# Altium project VCU.PrjPcb (part 1 of 2)
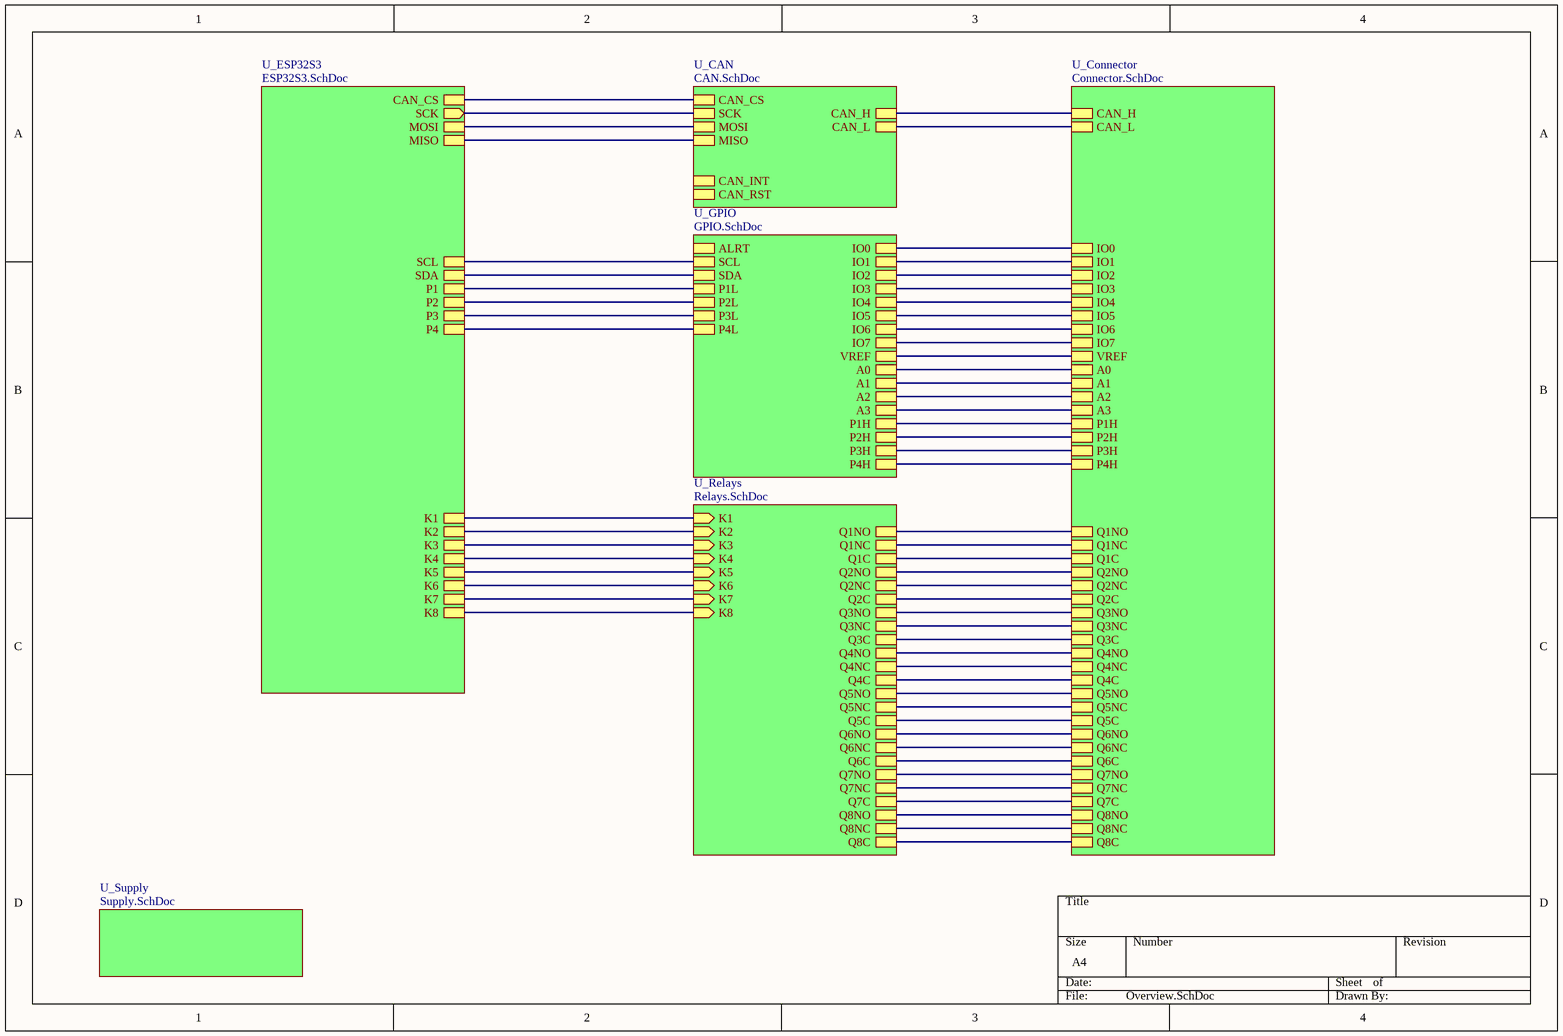
[diagram p0: Overview.SchDoc]
7 sheets, 101 parts. Net scope: hierarchical (ports join the sheet entries above them; power ports are global).
Board file: VCU.PcbDoc
Sheets:
  Overview.SchDoc
    U_ESP32S3 = ESP32S3.SchDoc
    U_CAN = CAN.SchDoc
    U_Relays = Relays.SchDoc
    U_GPIO = GPIO.SchDoc
    U_Supply = Supply.SchDoc
    U_Connector = Connector.SchDoc

## Sheet Overview.SchDoc
size A4; SheetNumber: 1; SheetTotal: 7

### Sub-sheets
U_CAN = CAN.SchDoc: CAN_CS, SCK, MOSI, MISO, CAN_H, CAN_L, CAN_INT, CAN_RST
U_Connector = Connector.SchDoc: Q1NO, Q1NC, Q1C, Q2NO, Q2NC, Q2C, Q3NO, Q3NC, Q3C, Q4NO, Q4NC, Q4C, Q5NO, Q5NC, Q5C, Q6NO, Q6NC, Q6C, Q7NO, Q7NC, Q7C, Q8NO, Q8NC, Q8C, CAN_H, CAN_L, IO0, IO1, IO2, IO3, IO4, IO5, IO6, IO7, VREF, A0, A1, A2, A3, P1H, P2H, P3H, P4H
U_ESP32S3 = ESP32S3.SchDoc: SCK (out), MISO, MOSI, CAN_CS, P1, P2, P3, P4, K1, K2, K3, K4, K5, K6, K7, K8, SDA, SCL
U_GPIO = GPIO.SchDoc: ALRT, SCL, SDA, A0, A1, A2, A3, IO0, IO1, IO2, IO3, IO4, IO5, IO6, IO7, VREF, P1L, P3L, P4L, P2L, P1H, P2H, P3H, P4H
U_Relays = Relays.SchDoc: K1 (in), K2 (in), K3 (in), K4 (in), K5 (in), K6 (in), K7 (in), K8 (in), Q1NO, Q1NC, Q1C, Q2NO, Q2NC, Q2C, Q3NO, Q3NC, Q3C, Q4NO, Q4NC, Q4C, Q5NO, Q5NC, Q5C, Q6NO, Q6NC, Q6C, Q7NO, Q7NC, Q7C, Q8NO, Q8NC, Q8C
U_Supply = Supply.SchDoc: no entries

### Nets
K1: sheet U_ESP32S3/K1, sheet U_Relays/K1
K2: sheet U_ESP32S3/K2, sheet U_Relays/K2
K3: sheet U_ESP32S3/K3, sheet U_Relays/K3
K4: sheet U_ESP32S3/K4, sheet U_Relays/K4
K5: sheet U_ESP32S3/K5, sheet U_Relays/K5
K6: sheet U_ESP32S3/K6, sheet U_Relays/K6
K7: sheet U_ESP32S3/K7, sheet U_Relays/K7
K8: sheet U_ESP32S3/K8, sheet U_Relays/K8
SCL: sheet U_ESP32S3/SCL, sheet U_GPIO/SCL
SDA: sheet U_ESP32S3/SDA, sheet U_GPIO/SDA
NetJ1_1: sheet U_Relays/Q1NO, sheet U_Connector/Q1NO
NetJ1_2: sheet U_Relays/Q1C, sheet U_Connector/Q1C
NetJ1_3: sheet U_Relays/Q1NC, sheet U_Connector/Q1NC
NetJ1_4: sheet U_Relays/Q2NO, sheet U_Connector/Q2NO
NetJ1_5: sheet U_Relays/Q2C, sheet U_Connector/Q2C
NetJ1_6: sheet U_Relays/Q2NC, sheet U_Connector/Q2NC
NetJ1_7: sheet U_Relays/Q3NO, sheet U_Connector/Q3NO
NetJ1_8: sheet U_Relays/Q3C, sheet U_Connector/Q3C
NetJ1_9: sheet U_Relays/Q3NC, sheet U_Connector/Q3NC
NetJ1_10: sheet U_Relays/Q4NO, sheet U_Connector/Q4NO
NetJ1_11: sheet U_Relays/Q4C, sheet U_Connector/Q4C
NetJ1_12: sheet U_Relays/Q4NC, sheet U_Connector/Q4NC
NetJ1_14: sheet U_Relays/Q5NO, sheet U_Connector/Q5NO
NetJ1_15: sheet U_Relays/Q5C, sheet U_Connector/Q5C
NetJ1_16: sheet U_Relays/Q5NC, sheet U_Connector/Q5NC
NetJ1_17: sheet U_Relays/Q6NO, sheet U_Connector/Q6NO
NetJ1_18: sheet U_Relays/Q6C, sheet U_Connector/Q6C
NetJ1_19: sheet U_Relays/Q6NC, sheet U_Connector/Q6NC
NetJ1_20: sheet U_Relays/Q7NO, sheet U_Connector/Q7NO
NetJ1_21: sheet U_Relays/Q7C, sheet U_Connector/Q7C
NetJ1_22: sheet U_Relays/Q7NC, sheet U_Connector/Q7NC
NetJ1_23: sheet U_Relays/Q8NO, sheet U_Connector/Q8NO
NetJ1_24: sheet U_Relays/Q8C, sheet U_Connector/Q8C
NetJ1_25: sheet U_Relays/Q8NC, sheet U_Connector/Q8NC
NetJ2_3: sheet U_GPIO/IO1, sheet U_Connector/IO1
NetJ2_4: sheet U_GPIO/IO3, sheet U_Connector/IO3
NetJ2_5: sheet U_GPIO/IO5, sheet U_Connector/IO5
NetJ2_6: sheet U_GPIO/IO7, sheet U_Connector/IO7
NetJ2_7: sheet U_GPIO/A0, sheet U_Connector/A0
NetJ2_8: sheet U_GPIO/A2, sheet U_Connector/A2
NetJ2_9: sheet U_GPIO/P1H, sheet U_Connector/P1H
NetJ2_10: sheet U_GPIO/P3H, sheet U_Connector/P3H
NetJ2_13: sheet U_CAN/CAN_L, sheet U_Connector/CAN_L
NetJ2_15: sheet U_GPIO/IO0, sheet U_Connector/IO0
NetJ2_16: sheet U_GPIO/IO2, sheet U_Connector/IO2
NetJ2_17: sheet U_GPIO/IO4, sheet U_Connector/IO4
NetJ2_18: sheet U_GPIO/IO6, sheet U_Connector/IO6
NetJ2_19: sheet U_GPIO/VREF, sheet U_Connector/VREF
NetJ2_20: sheet U_GPIO/A1, sheet U_Connector/A1
NetJ2_21: sheet U_GPIO/A3, sheet U_Connector/A3
NetJ2_22: sheet U_GPIO/P2H, sheet U_Connector/P2H
NetJ2_23: sheet U_GPIO/P4H, sheet U_Connector/P4H
NetJ2_25: sheet U_CAN/CAN_H, sheet U_Connector/CAN_H
NetR13_2: sheet U_ESP32S3/P1, sheet U_GPIO/P1L
NetR14_2: sheet U_ESP32S3/P2, sheet U_GPIO/P2L
NetR15_2: sheet U_ESP32S3/P3, sheet U_GPIO/P3L
NetR16_2: sheet U_ESP32S3/P4, sheet U_GPIO/P4L
NetU1_14: sheet U_ESP32S3/SCK, sheet U_CAN/SCK
NetU1_16: sheet U_ESP32S3/MOSI, sheet U_CAN/MOSI
NetU1_17: sheet U_ESP32S3/MISO, sheet U_CAN/MISO
NetU1_18: sheet U_ESP32S3/CAN_CS, sheet U_CAN/CAN_CS

## Sheet ESP32S3.SchDoc
size A4; SheetNumber: 3; SheetTotal: 7
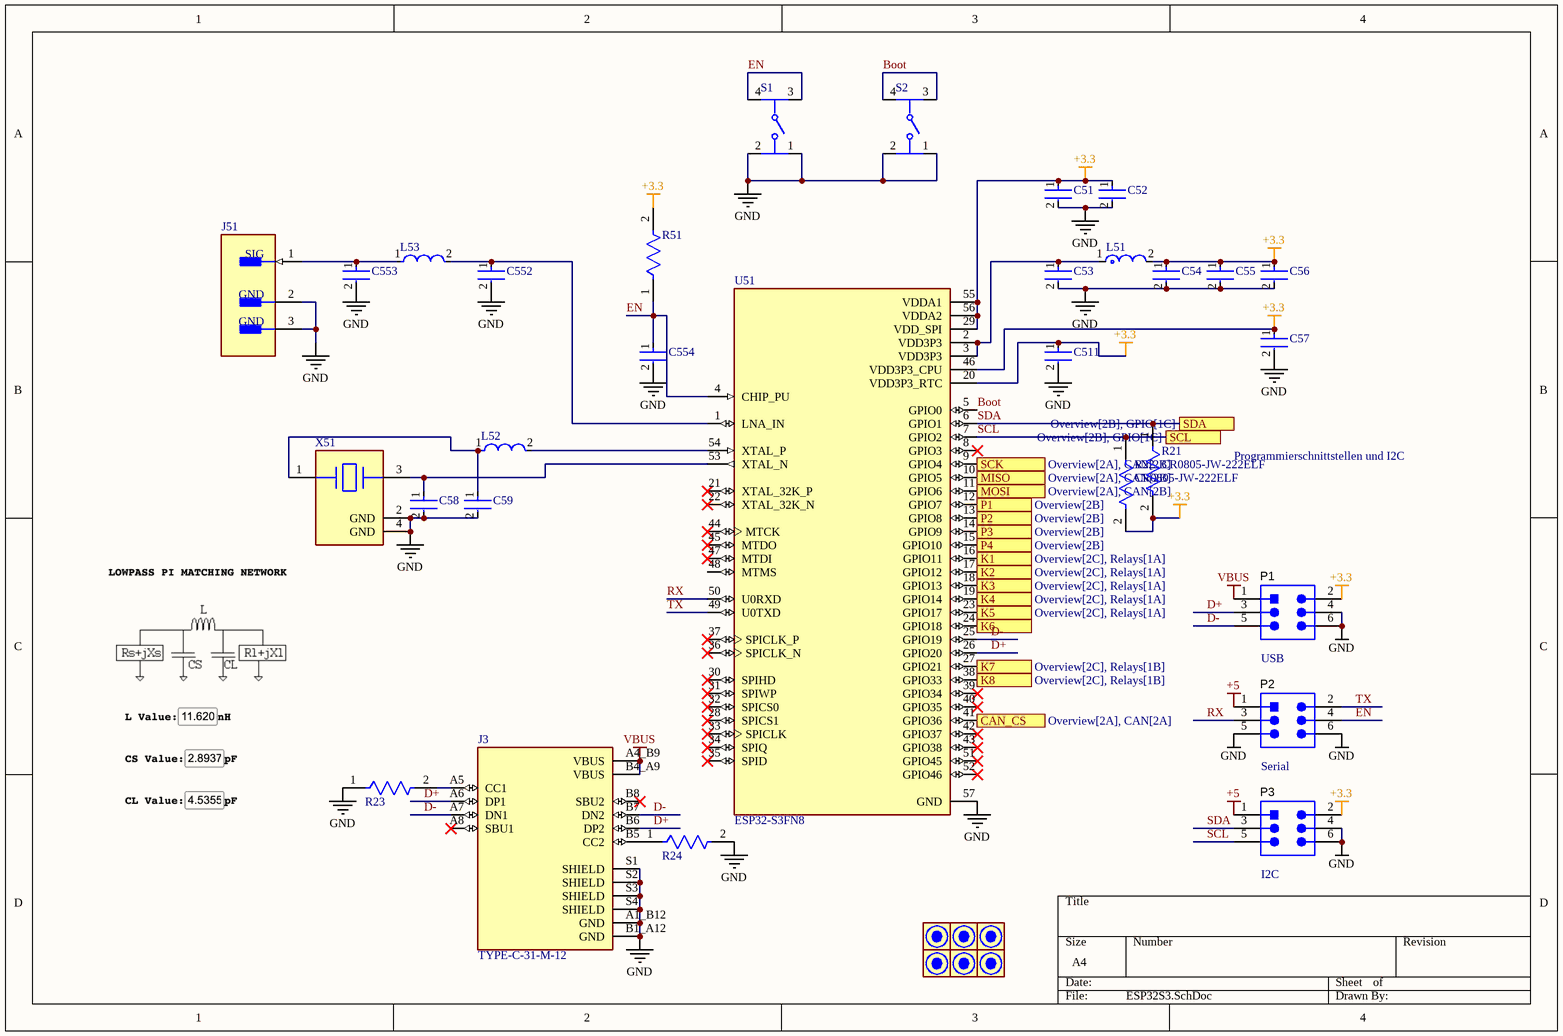
[diagram p1: ESP32S3.SchDoc]

### Parts
(Parts that share a designator on the sheet are numbered #1, #2 ... from top to bottom, then left to right.)
C51  GRM155R61A105KE15D  [FP-GRM15-0_1-MFG]  (value not drawn)
C52  C0603C103K8RACTU  [FP-C0603C-CF-MFG]  (value not drawn)
C53  CC0402KRX7R6BB104  [FP-CC0402-MFG]  (value not drawn)
C54  C0402C104K8PACTU  [FP-C0402-BB-MFG]  (value not drawn)
C55  GRM155R61A105KE15D  [FP-GRM15-0_1-MFG]  (value not drawn)
C56  CL05A106MP5NUNC  [FP-CL05A106MP5NUNC-MFG]  (value not drawn)
C57  C0402C104K8PACTU  [FP-C0402-BB-MFG]  (value not drawn)
C58  C0603C160J5GACTU  [FP-C0603C-CF-MFG]  (value not drawn)
C59  C0603C160J5GACTU  [FP-C0603C-CF-MFG]  (value not drawn)
C511  CC0402KRX7R6BB104  [FP-CC0402-MFG]  (value not drawn)
C552  GJM1555C1H2R8WB01D  [FP-GJM155-0_05-IPC_C]  (value not drawn)
C553  GJM1555C1H4R5BB01D  [FP-GJM155-0_05-IPC_C]  (value not drawn)
C554  C0402C123K4RACTU  [FP-C0402-BB-MFG]  (value not drawn)
J3  TYPE-C-31-M-12  [HRO_TYPE-C-31-M-12]
J51  U.FL-R-SMT-1(10)  [FP-U_FL-R-SMT-1_10-MFG]  (value not drawn)
L51  LQP03TN2N0B02D  [FP-LQP03TG_02-IPC_A]  (value not drawn)
L52  LQW15AN20NG00D  [FP-LQW15AN_00-W0_6-0_1-MFG]  (value not drawn)
L53  LQW15AN11NG00D  [FP-LQW15AN_00-W0_6-0_1-MFG]  (value not drawn)
M*#1  Passermarke  [Passermarke-Footprint-1]  (value not drawn)
M*#2  Passermarke  [Passermarke-Footprint-1]  (value not drawn)
M*#3  Passermarke  [Passermarke-Footprint-1]  (value not drawn)
M*#4  Passermarke  [Passermarke-Footprint-1]  (value not drawn)
M*#5  Passermarke  [Passermarke-Footprint-1]  (value not drawn)
M*#6  Passermarke  [Passermarke-Footprint-1]  (value not drawn)
P1  5-146130-2  [TECO-5-146130-2_V]  (value not drawn)
P2  5-146130-2  [TECO-5-146130-2_V]  (value not drawn)
P3  5-146130-2  [TECO-5-146130-2_V]  (value not drawn)
R21  CR0805-JW-222ELF  [FP-CR0805-IPC_B]
R22  CR0805-JW-222ELF  [FP-CR0805-IPC_B]
R23  CRCW06035K10FKEA  [FP-CRCW0603-e3-IPC_C]  (value not drawn)
R24  CRCW06035K10FKEA  [FP-CRCW0603-e3-IPC_C]  (value not drawn)
R51  CRCW04021K00FKED  [FP-CRCW0402-e3-MFG]  (value not drawn)
S1  (no value)  [FP-PTS645SM43SMTR92LFS-MFG]
S2  (no value)  [FP-PTS645SM43SMTR92LFS-MFG]
U51  ESP32-S3FN8  [QFN40P700X700X90-57N]
X51  X252040MMB4SI  [FP-ABM10-MFG]  (value not drawn)

### Ports
CAN_CS (see Overview[2A], CAN[2A]), K1 (see Overview[2C], Relays[1A]), K2 (see Overview[2C], Relays[1A]), K3 (see Overview[2C], Relays[1A]), K4 (see Overview[2C], Relays[1A]), K5 (see Overview[2C], Relays[1A]), K6 (see Overview[2C], Relays[1B]), K7 (see Overview[2C], Relays[1B]), K8 (see Overview[2C], Relays[1B]), MISO (see Overview[2A], CAN[2B]), MOSI (see Overview[2A], CAN[2B]), P1 (see Overview[2B]), P2 (see Overview[2B]), P3 (see Overview[2B]), P4 (see Overview[2B]), SCK (out, see Overview[2A], CAN[2B]), SCL (see Overview[2B], GPIO[1C]), SDA (see Overview[2B], GPIO[1C])

### Nets
+3.3: C51.1 C52.1 C54.1 C55.1 C56.1 C57.1 C511.1 L51.2 P1.2 P3.2 R21.2 R22.2 R51.2 U51.20(VDD3P3_RTC) U51.29(VDD_SPI) U51.46(VDD3P3_CPU) U51.55(VDDA1) U51.56(VDDA2)
+5: P2.1 P3.1
GND: C51.2 C52.2 C53.2 C54.2 C55.2 C56.2 C57.2 C58.2 C59.2 C511.2 C552.2 C553.2 C554.2 J3.A1_B12(GND) J3.B1_A12(GND) J3.S1(SHIELD) J3.S2(SHIELD) J3.S3(SHIELD) J3.S4(SHIELD) J51.2(GND) J51.3(GND) P1.4 P1.6 P2.5 P2.6 P3.4 P3.6 R23.1 R24.2 S1.1 S1.2 S2.1 S2.2 U51.57(GND) X51.2(GND) X51.4(GND)
VBUS: J3.A4_B9(VBUS) J3.B4_A9(VBUS) P1.1
Boot: S2.3 S2.4 U51.5(GPIO0)
D+: J3.A6(DP1) J3.B6(DP2) P1.3 U51.26(GPIO20)
D-: J3.A7(DN1) J3.B7(DN2) P1.5 U51.25(GPIO19)
EN: C554.1 P2.4 R51.1 S1.3 S1.4 U51.4(CHIP_PU)
K1: U51.16(GPIO11) ; port K1
K2: U51.17(GPIO12) ; port K2
K3: U51.18(GPIO13) ; port K3
K4: U51.19(GPIO14) ; port K4
K5: U51.23(GPIO17) ; port K5
K6: U51.24(GPIO18) ; port K6
K7: U51.27(GPIO21) ; port K7
K8: U51.38(GPIO33) ; port K8
RX: P2.3 U51.50(U0RXD)
SCL: P3.5 R22.1 U51.7(GPIO2) ; port SCL
SDA: P3.3 R21.1 U51.6(GPIO1) ; port SDA
TX: P2.2 U51.49(U0TXD)
NetC53_1: C53.1 L51.1 U51.2(VDD3P3) U51.3(VDD3P3)
NetC58_1: C58.1 U51.53(XTAL_N) X51.3
NetC59_1: C59.1 L52.1 X51.1
NetC552_1: C552.1 L53.2 U51.1(LNA_IN)
NetC553_1: C553.1 J51.1(SIG) L53.1
NetJ3_A5: J3.A5(CC1) R23.2
NetJ3_B5: J3.B5(CC2) R24.1
NetL52_2: L52.2 U51.54(XTAL_P)
NetR13_2: U51.12(GPIO7) ; port P1
NetR14_2: U51.13(GPIO8) ; port P2
NetR15_2: U51.14(GPIO9) ; port P3
NetR16_2: U51.15(GPIO10) ; port P4
NetU1_14: U51.9(GPIO4) ; port SCK
NetU1_16: U51.11(GPIO6) ; port MOSI
NetU1_17: U51.10(GPIO5) ; port MISO
NetU1_18: U51.41(GPIO36) ; port CAN_CS

Not connected (* = marked no-connect by the designer): J3 A8(SBU1)* B8(SBU2)*; U51 8(GPIO3)* 21(XTAL_32K_P)* 22(XTAL_32K_N)* 28(SPICS1)* 30(SPIHD)* 31(SPIWP)* 32(SPICS0)* 33(SPICLK)* 34(SPIQ)* 35(SPID)* 36(SPICLK_N)* 37(SPICLK_P)* 39(GPIO34)* 40(GPIO35)* 42(GPIO37)* 43(GPIO38)* 44(MTCK)* 45(MTDO)* 47(MTDI)* 48(MTMS) 51(GPIO45)* 52(GPIO46)*

### Notes on the sheet
- Programmierschnittstellen und I2C
- USB
- Serial
- (near P3) I2C

### Library data of the parts
C51 C55 = CMP-2008-04556-2: CAP CER 1UF 10V X5R 0402; Manufacturer: Murata; Material: Ceramic; Tolerance: 10%; Temperature Coefficient: 15%; Octopart: https://octopart.com/grm155r61a105ke15d-murata-197442; Manufacturer Part Number: GRM155R61A105KE15D; Lead Free: Yes; ComponentLink2Description: Datasheet; Temperature: -55°C to +85°C; Temperature Range High: +85°C; Height: 0.55mm; Capacitance: 1uF; Ipc Land Pattern Name: CAPC10050X50; ComponentLink2URL: https://search.murata.co.jp/Ceramy/image/img/A01X/G101/ENG/GRM155R61A105KE15-01A.pdf; Temperature Range Low: -55°C; Device Class L2: Capacitors; Voltage Rating: 10V; RoHS: TRUE; Device Class L1: Passive Components; Device Class L3: Ceramic Capacitors; Temperature Characteristic: X5R; Mouser Description: 0402 1 uF 10 V ±10% Tolerance X5R Surface Mount Multilayer Ceramic Capacitor; Automotive: No; Package: GRM15-0.1; Digikey Description: CAP CER 1UF 10V X5R 0402; Value: 1uF; Category: Cap
C52 = CMP-2006-03048-2: CAP CER 10000PF 10V X7R 0603; Manufacturer: KEMET; Material: Ceramic; Automotive Grade: Grade 1; Value: 10,000 pF; Tolerance: 0.1; Temperature Coefficient: 30ppm/°C; ComponentLink2Description: Datasheet; Automotive: Yes; Mouser Description: Multilayer Ceramic Capacitors MLCC - SMD/SMT 10volts 10000pF X7R 10%; Device Class L3: Ceramic Capacitors; Octopart: https://octopart.com/c0603c103k8ractu-kemet-8375724; Digikey Description: CAP CER 10000PF 10V X7R 0603; Temperature: -55°C to +125°C; Temperature Characteristic: X7R; Device Class L1: Passive Components; Capacitance: 10,000 pF; Lead Free: Yes; Voltage Rating: 10 V; Category: Cap; Height: 0.87mm; Package: C0603C-CF; RoHS: TRUE; Temperature Range High: +125°C; Device Class L2: Capacitors; ComponentLink2URL: https://api.kemet.com/component-edge/download/datasheet/C0603C100J5GACAUTO.pdf; Temperature Range Low: -55°C; Manufacturer Part Number: C0603C103K8RACTU
C53 C511 = CMP-03422-000748-1: CAP CER 0.1UF 10V X7R 0402; Manufacturer: YAGEO; Tolerance: 0.1; Value: 100 nF; Temperature Coefficient: 30ppm/°C; Material: Ceramic; Automotive Grade: NA; Ipc Land Pattern Name: CAPC10050X50; Temperature Range Low: -55°C; Temperature: -55°C to +125°C; Footprint Url: http://www.yageo.com/exep/pages/download/literatures/UPY-C_GEN_24.pdf; Device Class L2: Capacitors; ComponentLink2Description: Datasheet; Temperature Characteristic: X7R; Height: 0.55mm; Mouser Description: Multilayer Ceramic Capacitors MLCC - SMD/SMT 100nF 10V X7R 10%; Temperature Range High: +125°C; Package: CC0402; Digikey Description: CAP CER 0.1UF 10V X7R 0402; Automotive: No; Manufacturer Part Number: CC0402KRX7R6BB104; Voltage Rating: 10 V; Octopart: https://octopart.com/cc0402krx7r6bb104-yageo-8376509; Capacitance: 100 nF; ComponentLink2URL: http://www.yageo.com/documents/recent/UPY-GP_NP0_16V-to-50V_16.pdf; Category: Cap; Lead Free: Yes; Device Class L3: Ceramic Capacitors; RoHS: TRUE; Device Class L1: Passive Components
C54 C57 = CMP-2008-02046-2: CAP CER 0.1UF 10V X5R 0402; Manufacturer: Kemet; Material: Ceramic; Capacitance: 0.10 μF; Temperature Coefficient: 15%; Tolerance: 0.1; Value: 0.10 μF; Package: C0402-BB; Temperature: -55°C to +125°C; ComponentLink2Description: Datasheet; Temperature Characteristic: X5R; Device Class L1: Passive Components; Height: 0.55mm; Lead Free: Yes; ComponentLink2URL: https://content.kemet.com/datasheets/KEM_C1002_X7R_SMD.pdf; Device Class L2: Capacitors; Temperature Range Low: -55°C; Temperature Range High: +125°C; RoHS: TRUE; Octopart: https://octopart.com/c0402c104k8pactu-kemet-140039; Automotive: No; Mouser Description: Capacitor 100 nF 10 VDC 0402; Category: Cap; Voltage Rating: 10 V; Digikey Description: CAP CER 0.1UF 10V X5R 0402; Ipc Land Pattern Name: CAPC10050X50; Device Class L3: Ceramic Capacitors; Manufacturer Part Number: C0402C104K8PACTU
C56 = CMP-13271-000002-1: CAP CER 10UF 10V X5R 0402; Manufacturer: Samsung; Temperature Coefficient: 15%; Tolerance: 20%; Material: Ceramic; Octopart: https://octopart.com/cl05a106mp5nunc-samsung-22457395; Voltage Rating: 10V; RoHS: TRUE; Value: 10uF; Height: 0.7mm; Digikey Description: CAP CER 10UF 10V X5R 0402; Automotive: No; Package: CL05A106MP5NUNC; Device Class L1: Passive Components; Capacitance: 10uF; Temperature Range High: +85°C; ComponentLink2Description: Datasheet; Device Class L2: Capacitors; Temperature Characteristic: X5R; Manufacturer Part Number: CL05A106MP5NUNC; Temperature: -55°C to +85°C; ComponentLink2URL: http://www.samsungsem.com/kr/support/product-search/mlcc/__icsFiles/afieldfile/2019/05/10/19-CL05A106MP5NUNC.pdf; Device Class L3: Ceramic Capacitors; Category: Cap; Temperature Range Low: -55°C; Ipc Land Pattern Name: CAPC10050X50; Lead Free: Yes
C58 C59 = CMP-1035-00716-3: CAP CER 16PF 50V 5% NP0 0603; Manufacturer: KEMET; Automotive Grade: Grade 1; Material: Ceramic; Temperature Coefficient: 30ppm/°C; Tolerance: 0.05; Temperature Characteristic: C0G; Manufacturer Part Number: C0603C160J5GACTU; Octopart: https://octopart.com/c0603c160j5gactu-kemet-9143816; ComponentLink2URL: https://api.kemet.com/component-edge/download/datasheet/C0603C100J5GACAUTO.pdf; Category: Cap; Mouser Description: Multilayer Ceramic Capacitors MLCC - SMD/SMT 50volts 16pF C0G 5%; Device Class L1: Passive Components; Capacitance: 16 pF; Voltage Rating: 50 V; Temperature Range Low: -55°C; Automotive: Yes; Device Class L3: Ceramic Capacitors; Package: C0603C-CF; Temperature Range High: +125°C; Digikey Description: CAP CER 16PF 50V 5% NP0 0603; Value: 16 pF; Lead Free: Yes; Height: 0.87mm; Device Class L2: Capacitors; Temperature: -55°C to +125°C; ComponentLink2Description: Datasheet; RoHS: TRUE
C552 = CMP-2008-03767-2: Multi-Layer Ceramic Capacitor 2.8pF C0G  ±0.05pF 0402 Paper T/R; Voltage Rating (DC): 50V; Case Code (Metric): 1005; Max Operating Temperature: 125°C; Case Code (Imperial): 0402; Width: 0.02inch; Package Quantity: 10000; Case/Package: 0402; Depth: 0.5mm; Radiation Hardening: No; Mount: Surface Mount; Min Operating Temperature: -55°C; Termination: SMD/SMT; Capacitance: 2.8pF; Dielectric: C0G; Thickness: 0.022inch; Length: 1mm; Voltage Rating: 50V; Height: 0.5mm; Packaging: Tape and Reel
C553 = CMP-2008-03776-2: Multi-Layer Ceramic Capacitor 4.5pF C0G  ±0.1pF 0402 Paper T/R; Voltage Rating (DC): 50V; Case Code (Metric): 1005; Length: 1mm; Dielectric: C0G; Package Quantity: 1; Radiation Hardening: No; Case/Package: 0402; Termination: SMD/SMT; Min Operating Temperature: -55°C; Packaging: Tape and Reel; Voltage Rating: 50V; Capacitance: 4.5pF; Case Code (Imperial): 0402; Thickness: 0.022inch; Depth: 0.5mm; Max Operating Temperature: 125°C; Height: 0.5mm; Mount: Surface Mount; Width: 0.02inch
C554 = CMP-1034-01896-3: CAP CER 0.012UF 16V X7R 0402; Manufacturer: Kemet; Tolerance: 0.1; Capacitance: 12,000 pF; Temperature Coefficient: 15%; Value: 12,000 pF; Material: Ceramic; Automotive: No; Temperature Characteristic: X7R; Device Class L1: Passive Components; Height: 0.55mm; Manufacturer Part Number: C0402C123K4RACTU; Device Class L2: Capacitors; Package: C0402-BB; Temperature Range Low: -55°C; Ipc Land Pattern Name: CAPC10050X50; Temperature: -55°C to +125°C; Octopart: https://octopart.com/c0402c123k4ractu-kemet-136706; Lead Free: Yes; Temperature Range High: +125°C; Voltage Rating: 16 V; RoHS: TRUE; Mouser Description: Multilayer Ceramic Capacitors MLCC - SMD/SMT 16volts 12000pF X7R 10%; Category: Cap; ComponentLink2Description: Datasheet; ComponentLink2URL: https://content.kemet.com/datasheets/KEM_C1002_X7R_SMD.pdf; Device Class L3: Ceramic Capacitors; Digikey Description: CAP CER 0.012UF 16V X7R 0402
J3 = CMP-023-000000-1: USB Connectors 24 Receptacle 1 8.94*7.3mm RoHS; MF: HRO Electronics Co., Ltd.; Source: TYPE-C-31-M-12.SchLib; Pin Count: 16; Availability: Not in stock; Package: Package; Price: None; Check_prices: https://www.snapeda.com/parts/TYPE-C-31-M-12/HRO+Electronics+Co.%252C+Ltd./view-part/?ref=eda; MP: TYPE-C-31-M-12; Component Type: Standard; Value: *; SnapEDA_Link: https://www.snapeda.com/parts/TYPE-C-31-M-12/HRO+Electronics+Co.%252C+Ltd./view-part/?ref=snap; Design Item ID: TYPE-C-31-M-12
J51 = CMP-2000-05152-3: CONN U.FL RCPT STR 50 OHM SMD; Max Frequency: 6GHz; Connector Type: Coaxial; Body Plating: Silver; Body Material: Bronze; Impedance: 50R; Dielectric Material: Polymer; Insulation Resistance: 500MR; Gender: Male; Packaging: Cut Tape; Length: 3mm; Package Quantity: 2500; Termination: Solder; Lead Free: Lead Free; Series: U.FL; Min Operating Temperature: -40°C; Fastening Type: Snap; Contact Material: Brass; Orientation: Straight; Wire/Cable Type: Coaxial; Frequency: 6GHz; Contact Plating: Gold; Depth: 3.1mm; Weight: 0.001764oz; Max Operating Temperature: 90°C; Radiation Hardening: No; REACH SVHC: No SVHC; Mount: Surface Mount; Housing Color: Beige
L51 = CMP-06042-013297-1: Film type RF Inductor 2nH ±0.1nH 600mA 0.15Ω 0201 (0603); Current: 400mA; DC Resistance (DCR): 150mR; Core Material: Non-Magnetic; Q Factor: 14; Shielding: Unshielded; Self Resonant Frequency: 12.5GHz; Test Frequency: 500MHz; Height - Seated (Max): 0.013inch; Case/Package: 0201; Depth: 0.33mm; Width: 0.012inch; Mount: Surface Mount; Case Code (Imperial): 0201; Packaging: Tape and Reel; Max DC Current: 600mA; Resistor Type: Thin Film; Case Code (Metric): 0603; Length: 0.6mm; Termination: SMD/SMT; Max Operating Temperature: 125°C; Inductance: 2nH; REACH SVHC: No SVHC; DC Current: 600mA; Package Quantity: 15000; Height: 0.3mm; Military Standard: Not; Min Operating Temperature: -55°C; Current Rating: 600mA
L52 = CMP-06042-008146-1: Wire Wound RF Inductor 20nH ±2% 370mA 0.27Ω 0402 (1005); Q Factor: 25; Current: 850mA; DC Resistance (DCR): 270mR; Core Material: Air; Shielding: Unshielded; Test Frequency: 100MHz; Self Resonant Frequency: 4GHz; Mount: Surface Mount; Lead Free: Lead Free; Package Quantity: 10000; Case Code (Metric): 1005; Case/Package: 0402; DC Current: 370mA; Max DC Current: 370mA; Weight: 2.8E-05oz; Width: 0.02inch; Termination: SMD/SMT; Packaging: Tape and Reel; REACH SVHC: No SVHC; Height: 0.5mm; Case Code (Imperial): 0402; Depth: 0.7mm; Military Standard: Not; Radiation Hardening: No; Inductance Tolerance: 2%; Length: 1mm; Max Operating Temperature: 125°C; Min Operating Temperature: -55°C; Inductance: 20nH; Current Rating: 370mA; Tolerance: 2%
L53 = CMP-06042-008305-1: Wire Wound RF Inductor 11nH ±2% 500mA 0.14Ω 0402 (1005); Core Material: Non-Magnetic; Q Factor: 30; DC Resistance (DCR): 140mR; Shielding: Unshielded; Current: 370mA; Self Resonant Frequency: 5.5GHz; Test Frequency: 100MHz; Max DC Current: 500mA; Weight: 2.8E-05oz; Radiation Hardening: No; Mount: Surface Mount; Width: 0.02inch; Current Rating: 500mA; DC Current: 500mA; Packaging: Tape and Reel; Height: 0.5mm; Length: 1mm; Resistor Type: Wirewound; Inductance: 11nH; Height - Seated (Max): 0.024inch; Case Code (Metric): 1005; Max Operating Temperature: 125°C; Case/Package: 0402; Package Quantity: 10000; Tolerance: 2%; Termination: SMD/SMT; Military Standard: Not; Depth: 0.7mm; Min Operating Temperature: -55°C; Lead Free: Lead Free; Case Code (Imperial): 0402
M*#1-M*#6 = CMP-00001-2
P1-P3 = CMP-1684-00011-1: Male Header, Pitch 2.54 mm, 2 x 3 Position, Height 8.13 mm, -65 to 125 degC, RoHS, Tube; Max Supply Voltage: 5.5 V; Min Supply Voltage: 4.5 V; Nominal Supply Voltage: 5 V; Min Operating Temperature: -40 degC; ComponentLink1URL: http://www.te.com/; ComponentLink2Description: Datasheet; Pins: 3; Max Operating Temperature: 150 degC; PackageDescription: Male Header, Pitch 2.54 mm, 2 x 3 Position, Height 8.13 mm; Package Quantity: 3000; PackageReference: 5-146130-2; DatasheetVersion: Oct-15; ComponentLink1Description: Manufacturer URL; Radiation Hardening: No; Mount: Surface Mount; RoHSCompliant: true; Packaging: Tape and Reel; ComponentLink2URL: http://www.te.com/commerce/DocumentDelivery/DDEController?Action=showdoc&DocId=Customer+Drawing%7F146130%7FM%7Fpdf%7FEnglish%7FENG_CD_146130_M.pdf%7F5-146130-2
R21 R22 = CMP-07231-003724-1: Thick Film Chip Resistors 0805 2.2kΩ 0.125W 5% 200ppm/°C; Voltage Rating: 150V; Max Power Dissipation: 125mW; Resistance: 2.2kR; Packaging: Tape and Reel; REACH SVHC: No SVHC; Case Code (Metric): 2012; Thickness: 508um; Depth: 1.25mm; Radiation Hardening: No; Features: Moisture Resistant; Number of Terminations: 2; Max Operating Temperature: 155°C; Length: 2mm; Width: 1.25mm; Termination: SMD/SMT; Case/Package: 0805; Composition: Thick Film; Package Quantity: 1; Height: 0.024inch; Min Operating Temperature: -55°C; Voltage Rating (DC): 150V; Power Rating: 125mW; Mount: Surface Mount; Contact Plating: Tin; Tolerance: 5%; Military Standard: Not; Case Code (Imperial): 0805; Temperature Coefficient: 200ppm/°C
R23 R24 = CMP-1012-00590-3: RES Thick Film, 5.1kΩ, 1%, 0.1W, 100ppm/°C, 0603; Power Rating: 100mW; Voltage Rating (DC): 75V; Resistance: 5.1kR; Width: 0.85mm; Depth: 0.85mm; Military Standard: Not; Package Quantity: 5000; Case Code (Metric): 1608; Length: 1.55mm; Weight: 7.1E-05oz; Packaging: Tape and Reel; Temperature Coefficient: 100ppm/°C; Case Code (Imperial): 0603; Lead Free: Lead Free; Radiation Hardening: No; Contact Plating: Tin; Composition: Thick Film; Max Operating Temperature: 155°C; Termination: SMD/SMT; Case/Package: 0603; Min Operating Temperature: -55°C; Tolerance: 1%; Voltage Rating: 75V; Mount: Surface Mount; Height: 0.45mm
R51 = CMP-2002-08276-2: RES Thick Film, 1kΩ, 1%, 0.063W, 100ppm/°C, 0402; Resistance: 1kR; Power Rating: 63mW; Voltage Rating (DC): 50V; Package Quantity: 10; Termination: SMD/SMT; Width: 0.5mm; Military Standard: Not; Length: 1mm; Contact Plating: Tin; Mount: Surface Mount; Packaging: Tape and Reel; Case Code (Imperial): 0402; Tolerance: 1%; Weight: 2.3E-05oz; Number of Pins: 2; Case/Package: 0402; Case Code (Metric): 1005; Lead Free: Lead Free; Number of Terminations: 2; Max Power Dissipation: 63mW; Depth: 0.5mm; Temperature Coefficient: 100ppm/°C; Max Operating Temperature: 155°C; Height: 0.35mm; Features: Automotive AEC-Q200; Composition: Thick Film; Radiation Hardening: No; Voltage Rating: 50V; Min Operating Temperature: -55°C
S1 S2 = CMP-2000-05160-2: SWITCH TACTILE SPST-NO 0.05A 12V / PTS645SM43SMTR92LFS; Contact Resistance: 100mR; Throw Configuration: SPST; Illumination Type: Non-Illuminated; Mechanical Life: 100000Cycles; Current Rating: 50mA; Switch Function: Off-Mom; Actuator Length: 0.85mm; Actuator Material: Nylon; Actuator Type: Standard; Operating Force: 160gf; Min Operating Temperature: -20°C; REACH SVHC: No SVHC; Termination: Gull Wing; Case/Package: SMD/SMT; Packaging: Tape and Reel; Mount: Surface Mount; Voltage Rating (DC): 12V; Orientation: Straight; Lead Free: Lead Free; Contact Material: Silver; Color: Black; Max Current Rating: 50mA; Contact Plating: Silver; Depth: 9mm; Package Quantity: 1; Max Voltage Rating (DC): 12V; Length: 6mm; Max Operating Temperature: 60°C
U51 = ESP32-S3FN8: Espressif Systems [ENGINEERING SAMPLES]SMD IC , Dual-Core MCU, Wi-Fi 2.4G & BLE 5.0 combo, 8 MB Octal SPI PSRAM, QFN 56-pin, 7*7 mm; Check_prices: https://www.snapeda.com/parts/ESP32-S3FN8/Espressif+Systems/view-part/?ref=eda; MF: Espressif Systems; SnapEDA_Link: https://www.snapeda.com/parts/ESP32-S3FN8/Espressif+Systems/view-part/?ref=snap; Availability: In Stock; Price: None; Value: *; MP: ESP32-S3FN8; Package: None; Purchase-URL: https://pricing.snapeda.com/search/part/ESP32-S3FN8/?ref=eda
X51 = CMP-27762-005729-1: Crystal 40MHz ±20ppm 10pF SMD-4 2.5mm x 2mm; Frequency Stability: 30ppm; Series Resistance: 70R; Min Operating Temperature: -40°C; Height: 0.028inch; Frequency: 40MHz; Series: ABM10; Mount: Surface Mount; Termination: SMD/SMT; Package Quantity: 3000; Case/Package: SMD/SMT; Packaging: Tape and Reel; Tolerance: 20ppm; Length: 0.098inch; Number of Pins: 4; Load Capacitance: 10pF; RoHS Compliant: Yes; REACH SVHC: No SVHC; Width: 0.079inch; ESR (Equivalent Series Resistance): 70R; Frequency Tolerance: 20ppm; Max Operating Temperature: 85°C

## Sheet CAN.SchDoc
size A4; SheetNumber: 2; SheetTotal: 6
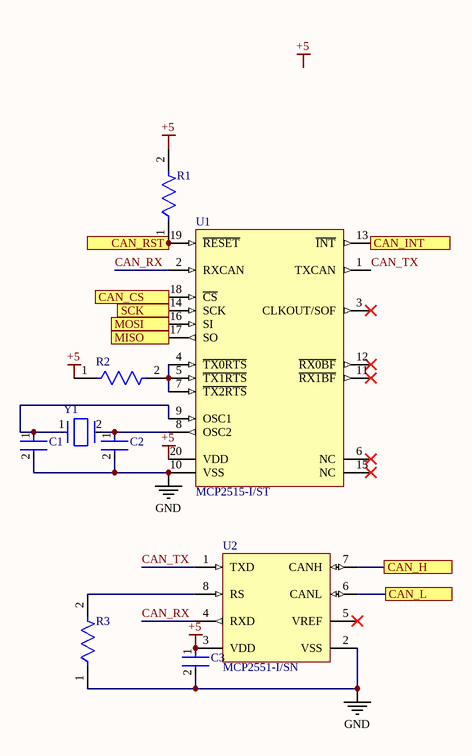
[diagram p2: CAN.SchDoc]

### Parts
C1  C0603C220J5GACTU  [FP-C0603C-CF-MFG]  (value not drawn)
C2  C0603C220J5GACTU  [FP-C0603C-CF-MFG]  (value not drawn)
C3  GRM033R60J104KE19D  [FP-GRM033-0_03-MFG]  (value not drawn)
R1  ERJ-2RKF1003X  [FP-ERJ2RK-IPC_C]  (value not drawn)
R2  ERJ-2RKF1003X  [FP-ERJ2RK-IPC_C]  (value not drawn)
R3  ERJ-3GEYJ100V  [FP-ERJ3G-MFG]  (value not drawn)
U1  MCP2515-I/ST  [TSSOP-ST20_N]
U2  MCP2551-I/SN  [MCHP-SN8_V]
Y1  ABLS-16.000MHZ-K4T  [FP-ABLS-MFG]  (value not drawn)

### Ports
CAN_CS, CAN_H, CAN_INT, CAN_L, CAN_RST, MISO, MOSI, SCK

### Nets
+5: C3.1 R1.2 R2.1 U1.20(VDD) U2.3(VDD)
GND: C1.2 C2.2 C3.2 R3.1 U1.10(VSS) U2.2(VSS)
CAN_RX: U1.2(RXCAN) U2.4(RXD)
CAN_TX: U1.1(TXCAN) U2.1(TXD)
NetC1_1: C1.1 U1.9(OSC1) Y1.1
NetC2_1: C2.1 U1.8(OSC2) Y1.2
NetJ2_13: U2.6(CANL) ; port CAN_L
NetJ2_25: U2.7(CANH) ; port CAN_H
NetR1_1: R1.1 U1.19(~{RESET}) ; port CAN_RST
NetR2_2: R2.2 U1.4(~{TX0RTS}) U1.5(~{TX1RTS}) U1.7(~{TX2RTS})
NetR3_2: R3.2 U2.8(RS)
NetU1_13: U1.13(~{INT}) ; port CAN_INT
NetU1_14: U1.14(SCK) ; port SCK
NetU1_16: U1.16(SI) ; port MOSI
NetU1_17: U1.17(SO) ; port MISO
NetU1_18: U1.18(~{CS}) ; port CAN_CS

Not connected (* = marked no-connect by the designer): U1 3(CLKOUT/SOF)* 6(NC)* 11(~{RX1BF})* 12(~{RX0BF})* 15(NC)*; U2 5(VREF)*

### Notes on the sheet
- Labels drawn without touching a wire or pin: +5

### Library data of the parts
C1 C2 = CMP-2006-03119-3: Cap Ceramic 22pF 50V C0G 5% SMD 0603 125°C Paper T/R; Manufacturer: KEMET; Description: C0603 22 pF C0G 30ppm/°C 5.00% 50 V; Temperature Coefficient: 30ppm/°C; Automotive Grade: Grade 1; Tolerance: 0.05; RoHS: TRUE; Temperature Characteristic: C0G; Capacitance: 22 pF; Device Class L3: Ceramic Capacitors; Digikey Description: Cap Ceramic 22pF 50V C0G 5% SMD 0603 125°C Paper T/R; ComponentLink2URL: https://api.kemet.com/component-edge/download/datasheet/C0603C100J5GACAUTO.pdf; ComponentLink2Description: Datasheet; Automotive: Yes; Temperature: -55°C to +125°C; Temperature Range High: +125°C; Package: C0603C-CF; Device Class L1: Passive Components; Device Class L2: Capacitors; Lead Free: Yes; Value: 22 pF; Manufacturer Part Number: C0603C220J5GACTU; Category: Cap; Mouser Description: Cap Ceramic 22pF 50V C0G 5% SMD 0603 125°C Paper T/R; Voltage Rating: 50 V; Height: 0.87mm; Material: Ceramic; Temperature Range Low: -55°C; Octopart: https://octopart.com/c0603c220j5gactu-kemet-98525
C3 = CMP-06035-000062-2: Chip Multilayer Ceramic Capacitors for General Purpose, 0201, 0.10uF, X5R, 15%, 10%, 6.3V; Capacitance: 100nF; Min Operating Temperature: -55°C; Lead Free: Lead Free; Radiation Hardening: No; Dielectric: X5R; Voltage Rating (DC): 6.3V; REACH SVHC: No SVHC; Case/Package: 0201; Voltage Rating: 6.3V; Length: 0.6mm; Max Operating Temperature: 85°C; Width: 0.012inch; Depth: 0.3mm; Material: Ceramic; Case Code (Metric): 0603; Thickness: 0.013inch; Packaging: Tape and Reel; Height: 0.3mm; Weight: 6E-06oz; Package Quantity: 1; Mount: Surface Mount; Voltage: 6.3V; Case Code (Imperial): 0201; Tolerance: 10%; Termination: SMD/SMT
R1 R2 = CMP-2002-00608-4: RES SMD 100K OHM 1% 1/10W 0402; Resistance: 100kR; Voltage Rating (DC): 50V; Power Rating: 100mW; Temperature Coefficient: 100ppm/°C; Case/Package: 0402; Length: 1mm; Package Quantity: 1; Radiation Hardening: No; Case Code (Metric): 1005; Contact Plating: Tin; Mount: Surface Mount; Depth: 0.5mm; Max Operating Temperature: 155°C; Lead Free: Lead Free; Width: 0.5mm; Composition: Thick Film; Case Code (Imperial): 0402; Tolerance: 1%; Termination: SMD/SMT; Number of Pins: 2; Height: 0.35mm; Voltage Rating: 50V; Military Standard: Not; REACH SVHC: No SVHC; Packaging: Tape and Reel; Min Operating Temperature: -55°C; Max Power Dissipation: 100mW; Features: Automotive AEC-Q200; Number of Terminations: 2
R3 = CMP-2000-00701-2: RES SMD 10 OHM 5% 1/10W 0603; Manufacturer: Panasonic; Voltage Rating: 75V; Power Rating: 0.1W; Description: Thick Film Resistors - SMD 0603 10ohms 5% AEC-Q200; Resistance: 10Ω; Value: 10Ω; Automotive Grade: Grade 0; Temperature Coefficient: 200ppm/°C; Device Class L2: Resistors; Tolerance: 5%; Device Class L3: Chip SMD Resistors; Digikey Description: RES SMD 10 OHM 5% 1/10W 0603; Package: ERJ3G; Automotive: Yes; RoHS: TRUE; Temperature: -55°C to +155°C; Ipc Land Pattern Name: CAPC16080X45; Series: ERJ; Lead Free: Yes; Mouser Description: Thick Film Resistors - SMD 0603 10ohms 5% AEC-Q200; Temperature Range Low: -55°C; Device Class L1: Passive Components; Temperature Range High: +155°C; ComponentLink2URL: https://industrial.panasonic.com/cdbs/www-data/pdf/RDA0000/AOA0000C301.pdf; Category: Res; Manufacturer Part Number: ERJ-3GEYJ100V; Composition: Thick Film; Height: 0.55mm; Footprint Url: https://industrial.panasonic.com/cdbs/www-data/pdf/RDA0000/DMA0000COL17.pdf; Octopart: https://octopart.com/erj-3geyj100v-panasonic-55389239; ComponentLink2Description: Datasheet
U1 = CMP-0186-00077-2: Stand-Alone CAN Controller With SPI Interface, 20-Pin TSSOP, Industrial Temperature; DatasheetVersion: revF, Oct-2010; ComponentLink1Description: Manufacturer URL; PackageDescription: 20-Lead Plastic Thin Shrink Small Outline (ST) - 4.4mm Body [TSSOP]; ComponentLink1URL: http://www.microchip.com/; RevisionNote: URLs added. DatasheetVersion updated.; PackageReference: TSSOP-ST20; Code_JEDEC: MO-153-AC; ComponentLink2Description: Datasheet; ComponentLink2URL: http://ww1.microchip.com/downloads/en/DeviceDoc/21801f.pdf; PackageVersion: revBB, Aug-2009; ComponentLink3URL: http://www.microchip.com/stellent/groups/techpub_sg/documents/packagingspec/en012702.pdf; ComponentLink3Description: Package Specification
U2 = CMP-0186-00138-3: High-Speed CAN Transceiver, / 1 Mb/s, 4.5 to 5.5 V, 8-Pin SOIC (SN), Industrial Temperature, RoHS, Tube; Manufacturer: Microchip; RoHSCompliant: true; PackageReference: SN8; ComponentLink1URL: http://www.microchip.com/; DatasheetVersion: Rev. F, 07/2010; ComponentLink2Description: Datasheet; ComponentLink2URL: http://ww1.microchip.com/downloads/en/DeviceDoc/21667f.pdf; ComponentLink3Description: Package Specification; PackageDescription: 8-Pin Small Outline Integrated Circuit, Body 4.9 x 3.9 mm, Pitch 1.27 mm; ComponentLink1Description: Manufacturer URL; Mounting Technology: Surface Mount; ComponentLink3URL: http://www.microchip.com/stellent/groups/techpub_sg/documents/packagingspec/en012702.pdf
Y1 = CMP-27762-000003-1: CRYSTAL 16.0000MHZ 18PF SMD; Manufacturer: Abracon; Frequency: 16MHz; Stability: 50ppm; Tolerance: 30ppm; Description: 16MHz ±30ppm Crystal 18pF 40 Ohms HC-49/US; Standoff Height: 0mm; Esr: 40Ω; ComponentLink2URL: https://abracon.com/Resonators/abls.pdf; Temperature Range High: +125°C; Package: ABLS; Device Class L3: Crystals; Temperature: -40°C to +125°C; Load Capacitance: 18pF; Device Class L2: Crystals / Oscillators; Mouser Description: Crystal 16MHz ±30ppm (Tol) ±50ppm (Stability) 18pF FUND 40Ohm 2-Pin HC-49/US SMD T/R; Category: Crys; ComponentLink2Description: Datasheet; Manufacturer Part Number: ABLS-16.000MHZ-K4T; Series: ABLS; Automotive: No; Octopart: https://octopart.com/abls-16.000mhz-k4t-abracon-18618626; RoHS: TRUE; Digikey Description: CRYSTAL 16.0000MHZ 18PF SMD; Temperature Range Low: -40°C; Lead Free: Yes; Height: 4.3mm; Device Class L1: Passive Components

## Sheet Relays.SchDoc
size A4; SheetNumber: 4; SheetTotal: 7
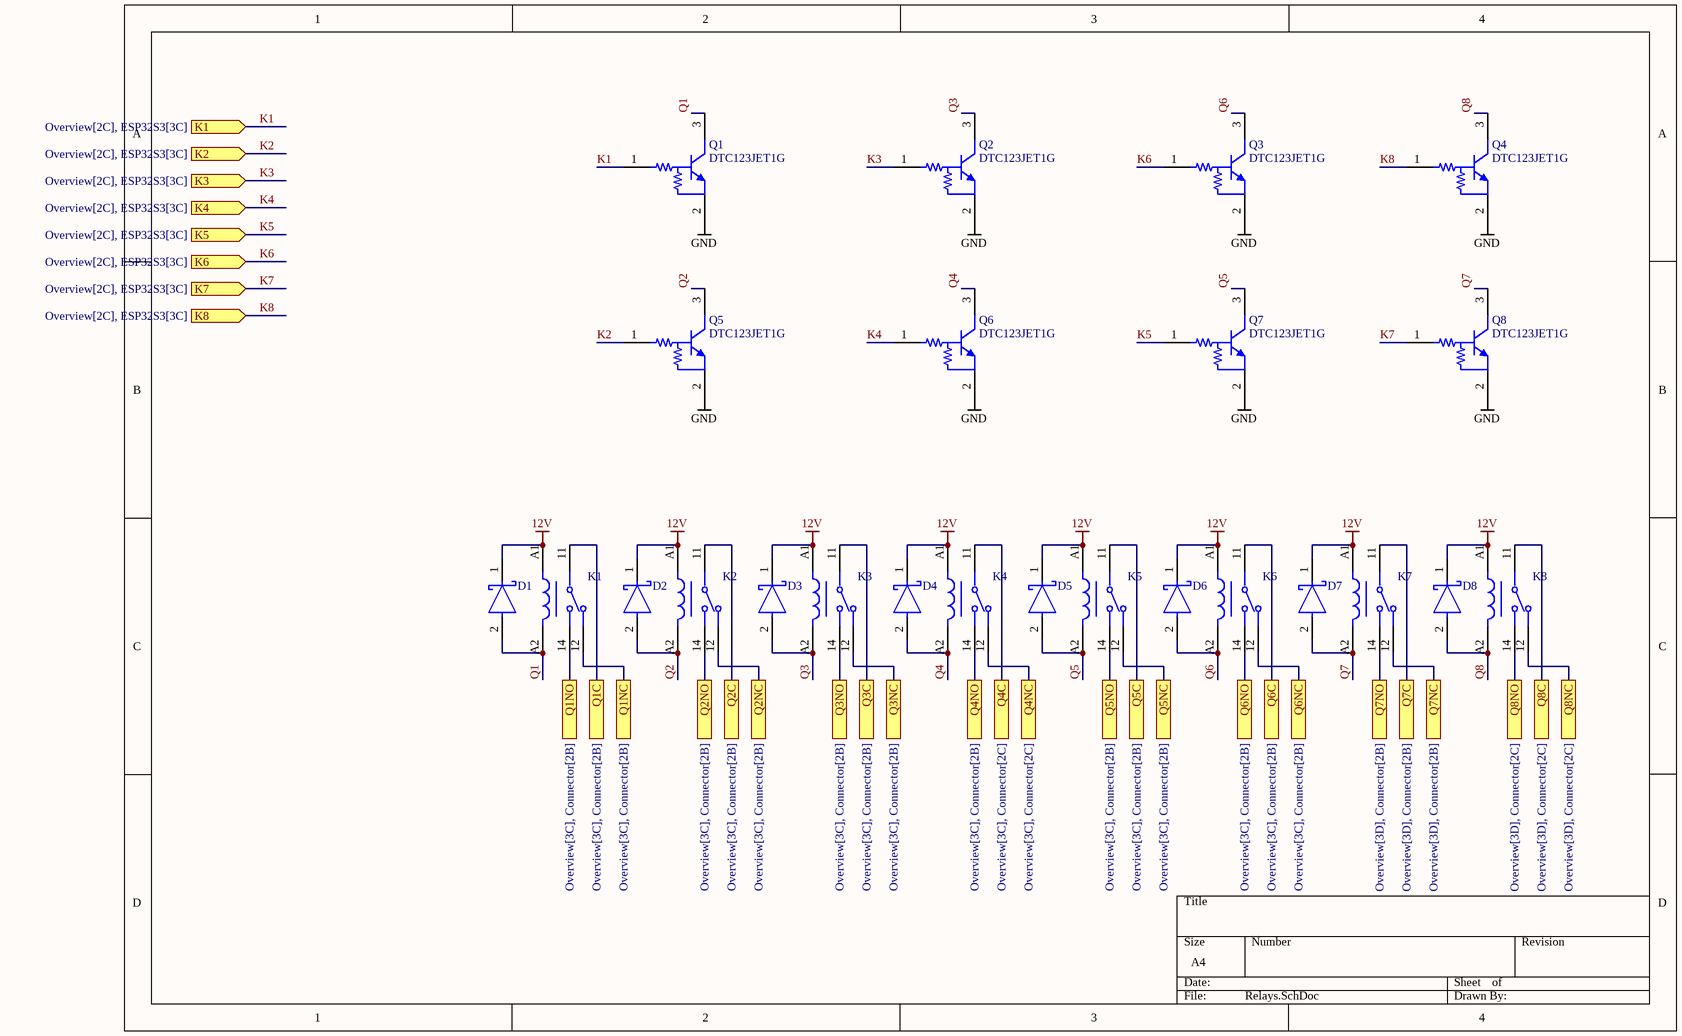
[diagram p3: Relays.SchDoc]

### Parts
D1  SBR80520LT1G  [FP-425-04-MFG]  (value not drawn)
D2  SBR80520LT1G  [FP-425-04-MFG]  (value not drawn)
D3  SBR80520LT1G  [FP-425-04-MFG]  (value not drawn)
D4  SBR80520LT1G  [FP-425-04-MFG]  (value not drawn)
D5  SBR80520LT1G  [FP-425-04-MFG]  (value not drawn)
D6  SBR80520LT1G  [FP-425-04-MFG]  (value not drawn)
D7  SBR80520LT1G  [FP-425-04-MFG]  (value not drawn)
D8  SBR80520LT1G  [FP-425-04-MFG]  (value not drawn)
K1  7-1415899-7  [FP-7-1415899-7-MFG]  (value not drawn)
K2  7-1415899-7  [FP-7-1415899-7-MFG]  (value not drawn)
K3  7-1415899-7  [FP-7-1415899-7-MFG]  (value not drawn)
K4  7-1415899-7  [FP-7-1415899-7-MFG]  (value not drawn)
K5  7-1415899-7  [FP-7-1415899-7-MFG]  (value not drawn)
K6  7-1415899-7  [FP-7-1415899-7-MFG]  (value not drawn)
K7  7-1415899-7  [FP-7-1415899-7-MFG]  (value not drawn)
K8  7-1415899-7  [FP-7-1415899-7-MFG]  (value not drawn)
Q1  DTC123JET1G  [ONSC-SC-75-3-463-01_V]
Q2  DTC123JET1G  [ONSC-SC-75-3-463-01_V]
Q3  DTC123JET1G  [ONSC-SC-75-3-463-01_V]
Q4  DTC123JET1G  [ONSC-SC-75-3-463-01_V]
Q5  DTC123JET1G  [ONSC-SC-75-3-463-01_V]
Q6  DTC123JET1G  [ONSC-SC-75-3-463-01_V]
Q7  DTC123JET1G  [ONSC-SC-75-3-463-01_V]
Q8  DTC123JET1G  [ONSC-SC-75-3-463-01_V]

### Ports
K1 (in, see Overview[2C], ESP32S3[3C]), K2 (in, see Overview[2C], ESP32S3[3C]), K3 (in, see Overview[2C], ESP32S3[3C]), K4 (in, see Overview[2C], ESP32S3[3C]), K5 (in, see Overview[2C], ESP32S3[3C]), K6 (in, see Overview[2C], ESP32S3[3C]), K7 (in, see Overview[2C], ESP32S3[3C]), K8 (in, see Overview[2C], ESP32S3[3C]), Q1C (see Overview[3C], Connector[2B]), Q1NC (see Overview[3C], Connector[2B]), Q1NO (see Overview[3C], Connector[2B]), Q2C (see Overview[3C], Connector[2B]), Q2NC (see Overview[3C], Connector[2B]), Q2NO (see Overview[3C], Connector[2B]), Q3C (see Overview[3C], Connector[2B]), Q3NC (see Overview[3C], Connector[2B]), Q3NO (see Overview[3C], Connector[2B]), Q4C (see Overview[3C], Connector[2C]), Q4NC (see Overview[3C], Connector[2C]), Q4NO (see Overview[3C], Connector[2B]), Q5C (see Overview[3C], Connector[2B]), Q5NC (see Overview[3C], Connector[2B]), Q5NO (see Overview[3C], Connector[2B]), Q6C (see Overview[3C], Connector[2B]), Q6NC (see Overview[3C], Connector[2B]), Q6NO (see Overview[3C], Connector[2B]), Q7C (see Overview[3D], Connector[2B]), Q7NC (see Overview[3D], Connector[2B]), Q7NO (see Overview[3D], Connector[2B]), Q8C (see Overview[3D], Connector[2C]), Q8NC (see Overview[3D], Connector[2C]), Q8NO (see Overview[3D], Connector[2C])

### Nets
12V: D1.1(C) D2.1(C) D3.1(C) D4.1(C) D5.1(C) D6.1(C) D7.1(C) D8.1(C) K1.A1 K2.A1 K3.A1 K4.A1 K5.A1 K6.A1 K7.A1 K8.A1
GND: Q1.2(E) Q2.2(E) Q3.2(E) Q4.2(E) Q5.2(E) Q6.2(E) Q7.2(E) Q8.2(E)
K1: Q1.1(B) ; port K1
K2: Q5.1(B) ; port K2
K3: Q2.1(B) ; port K3
K4: Q6.1(B) ; port K4
K5: Q7.1(B) ; port K5
K6: Q3.1(B) ; port K6
K7: Q8.1(B) ; port K7
K8: Q4.1(B) ; port K8
Q1: D1.2(A) K1.A2 Q1.3(C)
Q2: D2.2(A) K2.A2 Q5.3(C)
Q3: D3.2(A) K3.A2 Q2.3(C)
Q4: D4.2(A) K4.A2 Q6.3(C)
Q5: D5.2(A) K5.A2 Q7.3(C)
Q6: D6.2(A) K6.A2 Q3.3(C)
Q7: D7.2(A) K7.A2 Q8.3(C)
Q8: D8.2(A) K8.A2 Q4.3(C)
NetJ1_1: K1.14 ; port Q1NO
NetJ1_2: K1.11 ; port Q1C
NetJ1_3: K1.12 ; port Q1NC
NetJ1_4: K2.14 ; port Q2NO
NetJ1_5: K2.11 ; port Q2C
NetJ1_6: K2.12 ; port Q2NC
NetJ1_7: K3.14 ; port Q3NO
NetJ1_8: K3.11 ; port Q3C
NetJ1_9: K3.12 ; port Q3NC
NetJ1_10: K4.14 ; port Q4NO
NetJ1_11: K4.11 ; port Q4C
NetJ1_12: K4.12 ; port Q4NC
NetJ1_14: K5.14 ; port Q5NO
NetJ1_15: K5.11 ; port Q5C
NetJ1_16: K5.12 ; port Q5NC
NetJ1_17: K6.14 ; port Q6NO
NetJ1_18: K6.11 ; port Q6C
NetJ1_19: K6.12 ; port Q6NC
NetJ1_20: K7.14 ; port Q7NO
NetJ1_21: K7.11 ; port Q7C
NetJ1_22: K7.12 ; port Q7NC
NetJ1_23: K8.14 ; port Q8NO
NetJ1_24: K8.11 ; port Q8C
NetJ1_25: K8.12 ; port Q8NC

### Library data of the parts
D1-D8 = CMP-1055-00426-2: DIODE SCHOTTKY 20V 500MA SOD123; Forward Voltage: 385mV; Element Configuration: Single; Max Forward Surge Current (Ifsm): 5.5A; Peak Reverse Current: 250uA; Min Operating Temperature: -65°C; Case/Package: SOD-123-2; Halogen Free: Halogen Free; Number of Pins: 2; Max Operating Temperature: 125°C; Average Rectified Current: 500mA; Weight: 0.000363oz; Height: 1.17mm; Reverse Voltage (DC): 20V; Forward Current: 500mA; Max Reverse Voltage (DC): 20V; Width: 1.6mm; Termination: SMD/SMT; Max Repetitive Reverse Voltage (Vrrm): 20V; Package Quantity: 3000; Length: 2.69mm; Lead Free: Lead Free; Peak Non-Repetitive Surge Current: 5.5A; Packaging: Tape and Reel
K1-K8 = CMP-03395-000164-1: RELAY GEN PURPOSE SPDT 16A 12V; Coil Current: 33.33mA; Coil Power: 400mW; Resistance: 360R; Contact Voltage Rating (AC): 250V; Voltage Rating (AC): 400V; Operate Time: 8ms; Coil Voltage (DC): 12V; Throw Configuration: SPDT; Depth: 12.7mm; Height: 15.7mm; Coil Resistance: 360R; Max Operating Temperature: 85°C; ELV: Compliant; Number of Pins: 8; Packaging: Carton; Case/Package: DIP; Min Operating Temperature: -40°C; Width: 12.7mm; Length: 29mm; Contact Material: Silver; Termination: PCB; Contact Current Rating: 16A; Weight: 0.353oz
Q1-Q8 = CMP-0630-00201-1: Digital Transistor (BRT), R1=2.2 kOhm, R2=47 kOhm, NPN Transistor, 3-Pin SC-75, Pb-Free, Tape and Reel; Manufacturer: On Semiconductor; V(BR)CEO Min (V): 50; hFE Min: 80; R1/R2 Typ: 0.047; IC Continuous (A): 0.1; ComponentLink1URL: http://www.onsemi.com/; ComponentLink2URL: http://www.onsemi.cn/pub_link/Collateral/DTC123J-D.PDF; DatasheetVersion: Rev. 1; Mounting Technology: Surface Mount; ComponentLink2Description: Datasheet; PartNumber: DTC123JET1G; PackageDescription: 3-Pin Small Outline Transistor, Body 1.6 x 0.8 mm, Pitch 0.5 mm; Polarity: NPN; PackageVersion: Rev. F, 07/2005; ComponentLink3Description: Package Specification; PackageReference: SC-75-3-463-01; Packing: Tape and Reel; ComponentLink3URL: http://www.onsemi.com/pub_link/Collateral/463-01.PDF; ComponentLink1Description: Manufacturer URL; RoHS: TRUE

## Sheet GPIO.SchDoc
size A4; SheetNumber: 5; SheetTotal: 7
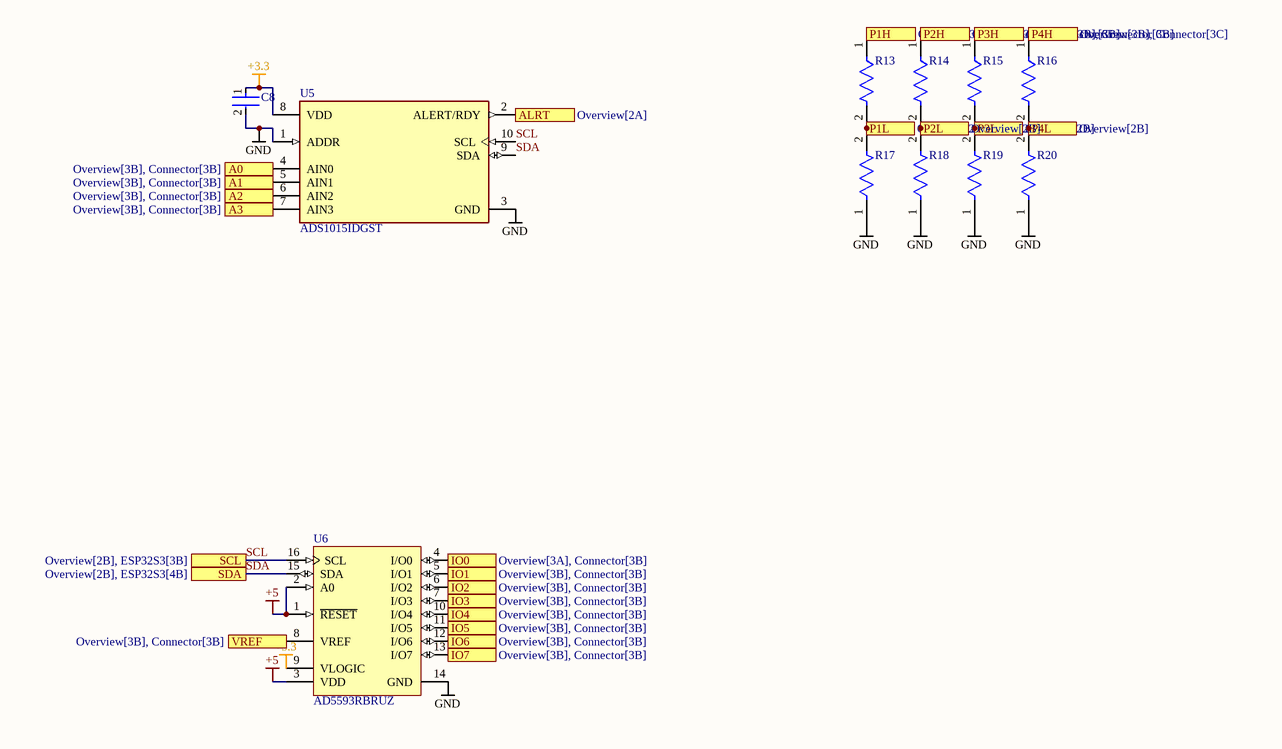
[diagram p4: GPIO.SchDoc]

### Parts
C8  GRM033R60J104KE19D  [FP-GRM033-0_03-MFG]  (value not drawn)
R13  CR1206-JW-752ELF  [FP-CR1206-IPC_B]  (value not drawn)
R14  CR1206-JW-752ELF  [FP-CR1206-IPC_B]  (value not drawn)
R15  CR1206-JW-752ELF  [FP-CR1206-IPC_B]  (value not drawn)
R16  CR1206-JW-752ELF  [FP-CR1206-IPC_B]  (value not drawn)
R17  CRCW04022K70FKED  [FP-CRCW0402-e3-IPC_A]  (value not drawn)
R18  CRCW04022K70FKED  [FP-CRCW0402-e3-IPC_A]  (value not drawn)
R19  CRCW04022K70FKED  [FP-CRCW0402-e3-IPC_A]  (value not drawn)
R20  CRCW04022K70FKED  [FP-CRCW0402-e3-IPC_A]  (value not drawn)
U5  ADS1015IDGST  [FP-DGS0010A-MFG]
U6  AD5593RBRUZ  [ADI-RU-16_L]

### Ports
A0 (see Overview[3B], Connector[3B]), A1 (see Overview[3B], Connector[3B]), A2 (see Overview[3B], Connector[3B]), A3 (see Overview[3B], Connector[3B]), ALRT (see Overview[2A]), IO0 (see Overview[3A], Connector[3B]), IO1 (see Overview[3B], Connector[3B]), IO2 (see Overview[3B], Connector[3B]), IO3 (see Overview[3B], Connector[3B]), IO4 (see Overview[3B], Connector[3B]), IO5 (see Overview[3B], Connector[3B]), IO6 (see Overview[3B], Connector[3B]), IO7 (see Overview[3B], Connector[3B]), P1H (see Overview[3B], Connector[3B]), P1L (see Overview[2B]), P2H (see Overview[3B], Connector[3B]), P2L (see Overview[2B]), P3H (see Overview[3B], Connector[3B]), P3L (see Overview[2B]), P4H (see Overview[3B], Connector[3C]), P4L (see Overview[2B]), SCL (see Overview[2B], ESP32S3[3B]), SDA (see Overview[2B], ESP32S3[4B]), VREF (see Overview[3B], Connector[3B])

### Nets
+3.3: C8.1 U5.8(VDD) U6.9(VLOGIC)
+5: U6.1(~{RESET}) U6.2(A0) U6.3(VDD)
GND: C8.2 R17.1 R18.1 R19.1 R20.1 U5.1(ADDR) U5.3(GND) U6.14(GND)
SCL: U5.10(SCL) U6.16(SCL) ; port SCL
SDA: U5.9(SDA) U6.15(SDA) ; port SDA
NetJ2_3: U6.5(I/O1) ; port IO1
NetJ2_4: U6.7(I/O3) ; port IO3
NetJ2_5: U6.11(I/O5) ; port IO5
NetJ2_6: U6.13(I/O7) ; port IO7
NetJ2_7: U5.4(AIN0) ; port A0
NetJ2_8: U5.6(AIN2) ; port A2
NetJ2_9: R13.1 ; port P1H
NetJ2_10: R15.1 ; port P3H
NetJ2_15: U6.4(I/O0) ; port IO0
NetJ2_16: U6.6(I/O2) ; port IO2
NetJ2_17: U6.10(I/O4) ; port IO4
NetJ2_18: U6.12(I/O6) ; port IO6
NetJ2_19: U6.8(VREF) ; port VREF
NetJ2_20: U5.5(AIN1) ; port A1
NetJ2_21: U5.7(AIN3) ; port A3
NetJ2_22: R14.1 ; port P2H
NetJ2_23: R16.1 ; port P4H
NetR13_2: R13.2 R17.2 ; port P1L
NetR14_2: R14.2 R18.2 ; port P2L
NetR15_2: R15.2 R19.2 ; port P3L
NetR16_2: R16.2 R20.2 ; port P4L
NetU5_2: U5.2(ALERT/RDY) ; port ALRT

### Library data of the parts
C8 = CMP-06035-000062-2: as C3 on sheet CAN; Min Operating Temperature: -55°C; Lead Free: Lead Free; Radiation Hardening: No; Dielectric: X5R; Voltage Rating (DC): 6.3V; REACH SVHC: No SVHC; Case/Package: 0201; Voltage Rating: 6.3V; Length: 0.6mm; Max Operating Temperature: 85°C; Width: 0.012inch; Depth: 0.3mm; Material: Ceramic; Case Code (Metric): 0603; Thickness: 0.013inch; Packaging: Tape and Reel; Height: 0.3mm; Weight: 6E-06oz; Package Quantity: 1; Mount: Surface Mount; Voltage: 6.3V; Case Code (Imperial): 0201; Tolerance: 10%; Termination: SMD/SMT
R13-R16 = CMP-07231-003675-1: Thick Film Chip Resistors 1206 7.5kΩ 0.25W 5% 200ppm/°C; Resistance: 7.5kR; Voltage Rating: 200V; Power Rating: 250mW; Composition: Thick Film; Temperature Coefficient: 200ppm/°C; Tolerance: 5%; Depth: 1.6mm; Max Operating Temperature: 155°C; Width: 1.6mm; Min Operating Temperature: -55°C; Height: 0.6mm; Case Code (Imperial): 1206; Military Standard: Not; Case/Package: 1206; Mount: Surface Mount; Case Code (Metric): 3216; Contact Plating: Tin; Thickness: 610um; Radiation Hardening: No; Package Quantity: 5000; Termination: SMD/SMT; Packaging: Tape and Reel; Length: 3.2mm
R17-R20 = CMP-2002-08466-2: RES Thick Film, 2.7kΩ, 1%, 0.063W, 100ppm/°C, 0402; Power Rating: 63mW; Voltage Rating (DC): 50V; Resistance: 2.7kR; Termination: SMD/SMT; Composition: Thick Film; Packaging: Tape and Reel; Tolerance: 1%; Number of Pins: 2; Contact Plating: Tin; Max Operating Temperature: 155°C; Depth: 0.5mm; Features: Automotive AEC-Q200; Lead Free: Lead Free; Number of Terminations: 2; Case/Package: 0402; Max Power Dissipation: 63mW; Radiation Hardening: No; Height: 0.35mm; Min Operating Temperature: -55°C; Width: 0.02inch; Military Standard: Not; Package Quantity: 10; Weight: 2.3E-05oz; Temperature Coefficient: 100ppm/°C; Case Code (Metric): 1005; Voltage Rating: 50V; Length: 1mm; Case Code (Imperial): 0402
U5 = CMP-0003-00377-3: IC ADC 12BIT SIGMA-DELTA 10VSSOP; Supply Type: Single; Number of Converters: 1; Number of Bits: 12; Number of Inputs: 4; Sampling Rate: 3.3KS/s; Conversion Rate: 3300S/s; Min Supply Voltage: 2V; Interface: I2C; Operating Supply Voltage: 3.3V; Polarity: Bipolar; Nominal Supply Current: 150uA; Integral Nonlinearity (INL): 0.5LSB; Max Power Dissipation: 900uW; Max Supply Voltage (DC): 5.5V; Resolution: 12b; Width: 3mm; Min Operating Temperature: -40°C; Contact Plating: Gold; Number of A/D Converters: 1; Max Operating Temperature: 125°C; Height: 1.02mm; Case/Package: VSSOP; Package Quantity: 250; Number of Elements: 1; Lead Free: Lead Free; Number of Pins: 10; Radiation Hardening: No; Termination: SMD/SMT; Length: 3mm; Min Supply Voltage (DC): 2V; Power Dissipation: 900uW; Number of Channels: 4; Max Supply Voltage: 5.5V; REACH SVHC: No SVHC; Packaging: Tape and Reel
U6 = CMP-2000-05745-1: Configurable ADC/DAC with On-Chip Reference, I2C Interface, 8-Channel, 12-Bit, 1.8 to 5.5 V, -40 to 105 degC, 16-Pin TSSOP (RU), RoHS, Tube; Manufacturer: AnalogDevicesInc.; Unit Weight: 0.006102oz; Package Version: 11/2002; Settling Time: 6us; Input Voltage: 5.5V; SNR - Signal to Noise Ratio: 81dB; Architecture: Segment; Supply Voltage - Min: 2.7V; Number of Converters: 9Converter; Number of ADC Channels: 8Channel; Output Type: Digital; Brand: AnalogDevices; Interface Type: Serial,I2C,SPI; Input Type: Analog,Digital; Reference Voltage: 2.5V; Sampling Rate: 400kS/s; Shutdown: NoShutdown; Resolution: 12bit; Maximum Operating Temperature: +105C; Datasheet Version: Rev. B, 01/2016; Mounting Technology: SurfaceMount; Factory Pack Quantity: 96; Manufacturer URL: http://www.analog.com/; Mounting Style: SMD/SMT; Package / Case: TSSOP-16; Operating Supply Voltage: 5.5V; Series: AD5593R; Package Description: 16-Pin Thin Shrink Small Outline Package, Body 5 x 4.4 mm, Pitch 0.65 mm; Minimum Operating Temperature: -40C; Datasheet URL: http://www.analog.com/media/en/technical-documentation/data-sheets/AD5593R.pdf; Package Reference: RU-16; RoHS: True; Number of DAC Channels: 8Channel; Product: MultichannelADCs/DACs; Number of Channels: 8Channel; Package URL: http:/www.analog.com/static/imported-files/packages/36244347913743854010197452789RU16.pdf; Product Category: DataAcquisitionADCs/DACs-Specialized; Type: ConfigurableADC/DACwithOn-ChipReference; Packaging: Tube; Supply Voltage - Max: 5.5V